# EAGLE design EnvSens (EAGLE 9.6.2)
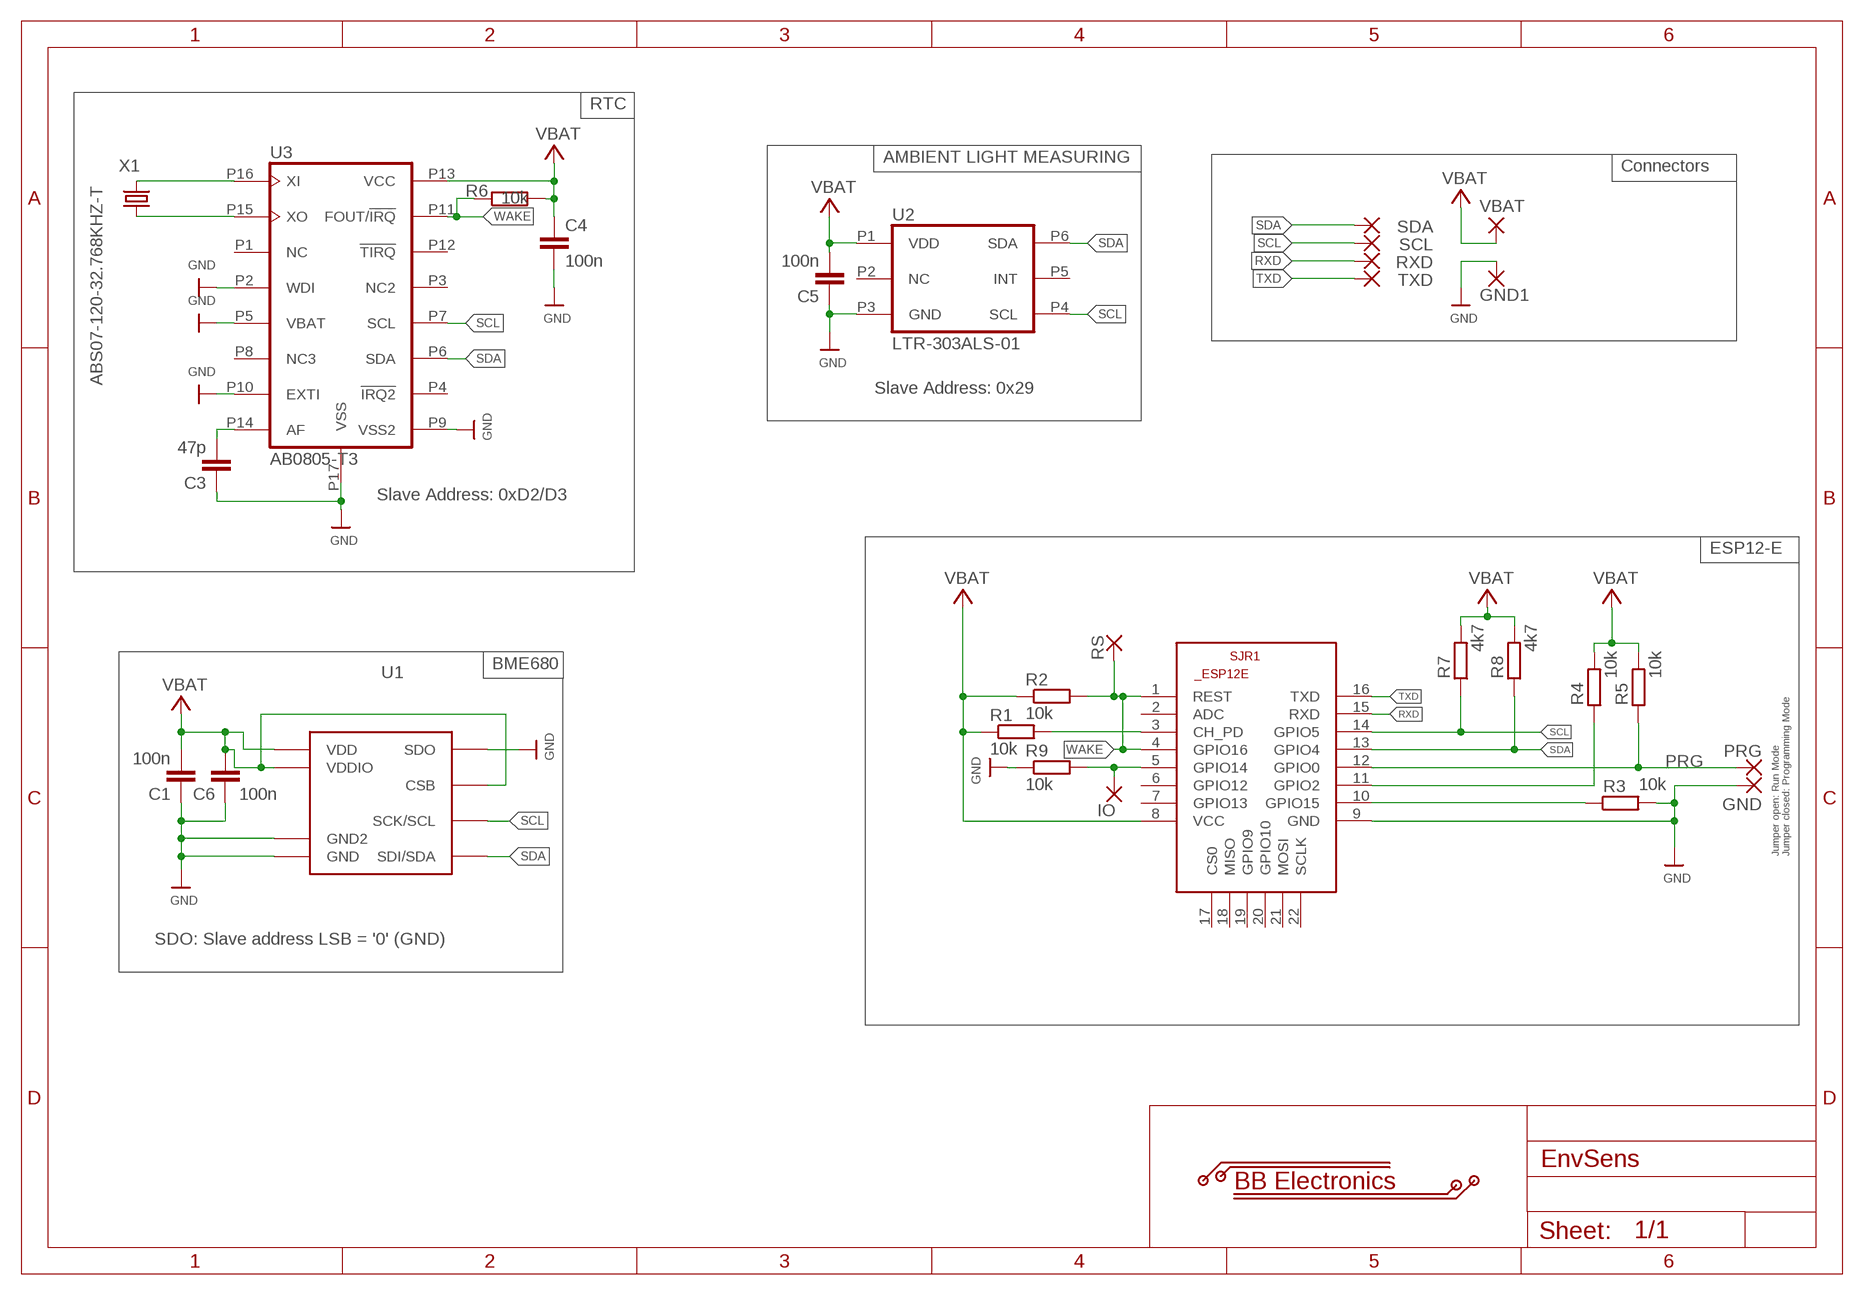
[diagram p0: schematic, sheet 1]

## Parts
C1  100n  C0603  [0603]
C3  47p  C0603  [0603]
C4  100n  C0603  [0603]
C5  100n  C0603  [0603]
C6  100n  C0603  [0603]
GND  SMD2  [SMD1,27-2,54]
GND1  SMD5  [SMD2,54-5,08]
IO  SMD2  [SMD1,27-2,54]
PRG  SMD2  [SMD1,27-2,54]
R1  10k  R0603  [0603]
R2  10k  R0603  [0603]
R3  10k  R0603  [0603]
R4  10k  R0603  [0603]
R5  10k  R0603  [0603]
R6  10k  R0603  [0603]
R7  4k7  R0603  [0603]
R8  4k7  R0603  [0603]
R9  10k  R0603  [0603]
RS  SMD2  [SMD1,27-2,54]
RXD  SMD2  [SMD1,27-2,54]
SCL  SMD2  [SMD1,27-2,54]
SDA  SMD2  [SMD1,27-2,54]
SJR1  ESP8266-12EESP12E  [ESP8266-ESP12E]
TXD  SMD2  [SMD1,27-2,54]
U1  BME680  [BME680]
U2  LTR-303ALS-01  [6-DFN]
U3  AB0805-T3  [16-VFQFN]
VBAT  SMD5  [SMD2,54-5,08]
X1  ABS07-120-32.768KHZ-T  [ABS07-120-32.768KHZ-T]

## Nets
GND: C1.P1 C3.P1 C4.P2 C5.P1 C6.P1 GND1.1(P) GND.1(P) R3.P2 R9.P1 SJR1.9(GND) U1.P1(GND) U1.P5(SDO) U1.P7(GND2) U2.P3(GND) U3.P2(WDI) U3.P5(VBAT) U3.P9(VSS2) U3.P10(EXTI) U3.P17(VSS)
GPIO: IO.1(P) R9.P2 SJR1.5(GPIO14)
N$1: R1.P2 SJR1.3(CH_PD)
N$2: R3.P1 SJR1.10(GPIO15)
N$4: R4.P1 SJR1.11(GPIO2)
N$5: C3.P2 U3.P14(AF)
N$6: U3.P16(XI) X1.P2
N$7: U3.P15(XO) X1.P1
PRG: PRG.1(P) R5.P1 SJR1.12(GPIO0)
RXD: RXD.1(P) SJR1.15(RXD)
SCL: R7.P1 SCL.1(P) SJR1.14(GPIO5) U1.P4(SCK/SCL) U2.P4(SCL) U3.P7(SCL)
SDA: R8.P1 SDA.1(P) SJR1.13(GPIO4) U1.P3(SDI/SDA) U2.P6(SDA) U3.P6(SDA)
TXD: SJR1.16(TXD) TXD.1(P)
VBAT: C1.P2 C4.P1 C5.P2 C6.P2 R1.P1 R2.P1 R4.P2 R5.P2 R6.P2 R7.P2 R8.P2 SJR1.8(VCC) U1.P2(CSB) U1.P6(VDDIO) U1.P8(VDD) U2.P1(VDD) U3.P13(VCC) VBAT.1(P)
WAKE: R2.P2 R6.P1 RS.1(P) SJR1.1(REST) SJR1.4(GPIO16) U3.P11(FOUT/!IRQ!)
Unconnected: SJR1.2(ADC) SJR1.6(GPIO12) SJR1.7(GPIO13) SJR1.17(CS0) SJR1.18(MISO) SJR1.19(GPIO9) SJR1.20(GPIO10) SJR1.21(MOSI) SJR1.22(SCLK) U2.P2(NC) U2.P5(INT) U3.P1(NC) U3.P3(NC2) U3.P4(!IRQ2!) U3.P8(NC3) U3.P12(!TIRQ!)

## Notes on the sheet
- RTC
- AMBIENT LIGHT MEASURING
- Connectors
- Slave Address: 0x29
- Slave Address: 0xD2/D3
- ESP12-E
- BME680
- Jumper open: Run Mode
  Jumper closed: Programming Mode
- SDO: Slave address LSB = '0' (GND)

## Library data of the parts
C1 C3-C6 = eigenebib:C0603
GND IO PRG RS RXD SCL SDA TXD = wirepad:SMD2: SMD PAD
GND1 VBAT = wirepad:SMD5: SMD PAD
R1-R9 = eigenebib:R0603
SJR1 = esp12e:ESP8266-12E: ESP8266-12E Library for Eagle CAD The author not responsible for any damages or errors!. Created by Suhail jr.lt;/author>
U1 = eigenebib:BME680
U2 = eigenebib:LTR-303ALS-01: SENSOR OPT AMBIENT 6DFN, Digikey: 160-2161-1-ND
U3 = eigenebib:AB0805-T3: Digikey: 535-11930-1-ND
X1 = eigenebib:ABS07-120-32.768KHZ-T: CRYSTAL 32.7680KHZ 6PF SMD, Digikey: 535-11937-1-ND

## Board
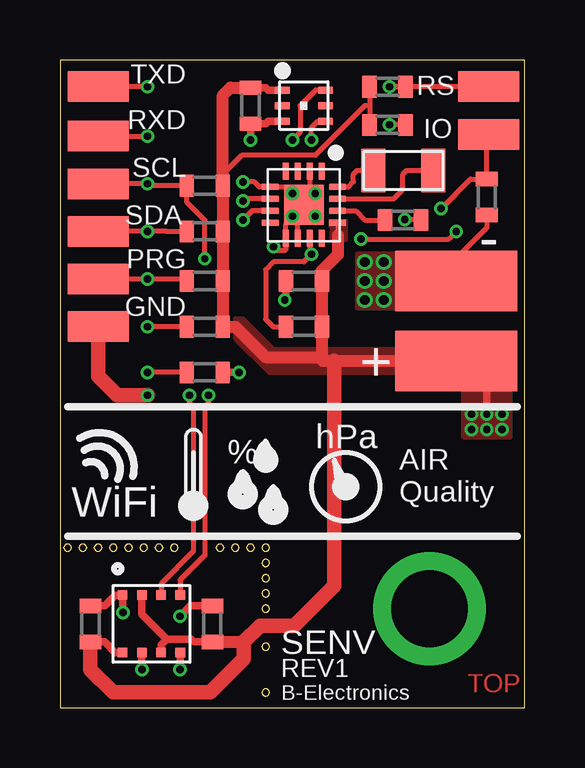
[diagram p1: board, top side]
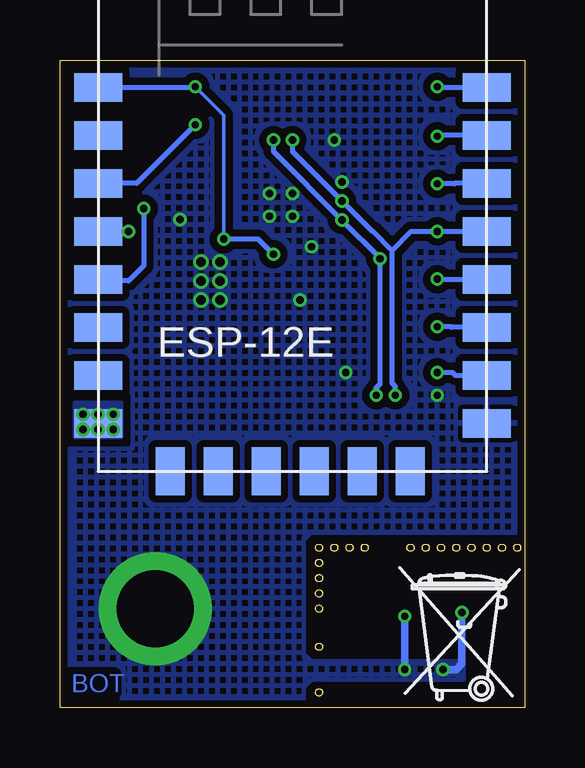
[diagram p2: board, bottom side, seen from below]

Size 19.37 x 26.99 mm. Coordinates in mm from the lower left corner, seen from the top.
Outline: 8.42,4.11 8.42,4.14 arc-165 8.72,4.15 8.72,4.14 8.72,4.11 arc-165 8.42,4.1 8.42,4.11
Outline: 3.34,6.65 3.34,6.68 3.34,6.69 arc-165 3.65,6.68 3.65,6.65 3.64,6.64 arc-165 3.34,6.65
Outline: 8.42,5.38 8.42,5.41 8.42,5.42 arc-165 8.72,5.41 8.72,5.38 8.72,5.37 arc-165 8.42,5.38
Outline: 8.42,2.52 8.42,2.56 8.42,2.56 arc-165 8.72,2.56 8.72,2.52 8.72,2.52 arc-165 8.42,2.52
Outline: 1.44,6.65 1.44,6.68 arc-165 1.74,6.69 1.74,6.68 1.74,6.65 arc-165 1.44,6.64 1.44,6.65
Outline: 4.61,6.65 4.61,6.68 4.61,6.69 arc-165 4.92,6.68 4.92,6.65 4.91,6.64 arc-165 4.61,6.65
Outline: 2.07,6.65 2.07,6.68 arc-165 2.37,6.69 2.38,6.68 2.38,6.65 arc-165 2.07,6.64 2.07,6.65
Outline: 8.42,4.75 8.42,4.78 8.42,4.79 arc-165 8.72,4.78 8.72,4.75 8.72,4.74 arc-165 8.42,4.75
Outline: 8.42,6.02 8.42,6.05 arc-165 8.72,6.06 8.72,6.05 8.72,6.02 arc-165 8.42,6.01 8.42,6.02
Outline: 7.15,6.65 7.15,6.68 arc-165 7.45,6.69 7.46,6.68 7.46,6.65 arc-165 7.15,6.64 7.15,6.65
Outline: 3.98,6.65 3.98,6.68 3.98,6.69 arc-165 4.28,6.68 4.28,6.65 4.28,6.64 arc-165 3.98,6.65
Outline: 8.42,6.65 8.42,6.68 arc-165 8.72,6.69 8.72,6.68 8.72,6.65 arc-165 8.42,6.64 8.42,6.65
Outline: 0.8,6.65 0.8,6.68 0.8,6.69 arc-165 1.1,6.68 1.1,6.65 1.1,6.64 arc-165 0.8,6.65
Outline: 8.42,0.62 8.42,0.65 arc-165 8.72,0.66 8.72,0.65 8.72,0.62 arc-165 8.42,0.61 8.42,0.62
Outline: 6.51,6.65 6.51,6.68 arc-165 6.82,6.69 6.82,6.68 6.82,6.65 arc-165 6.52,6.64 6.51,6.65
Outline: 7.79,6.65 7.79,6.68 arc-165 8.09,6.69 8.09,6.68 8.09,6.65 arc-165 7.79,6.64 7.79,6.65
Outline: 0.17,6.65 0.17,6.68 0.17,6.69 arc-165 0.47,6.68 0.47,6.65 0.47,6.64 arc-165 0.17,6.65
Outline: 2.71,6.65 2.71,6.68 arc-165 3.01,6.69 3.01,6.68 3.01,6.65 arc-165 2.71,6.64 2.71,6.65
Outline: 0,26.99 0,0 19.37,0 19.37,26.99 0,26.99
Copper layers (1*16): Top 0.018mm / dielectric 1.55mm / Bottom 0.018mm
Design rules "Multi-CB_2L_125um-Tracks_OL35um *": minimum track width 0.125mm, minimum drill 0.2mm, track to track 0.125mm, track to pad 0.125mm, pad to pad 0.125mm, via to via 0.125mm, smd to smd 0mil, copper to edge 0.2mm, drill to drill 0.2mm, minimum pad ring 0.125mm, minimum via ring 0.125mm, stop-mask expansion 2mil, vias tented up to drill 0.45mm, thermal gap 0.2mm

### Footprints (pad centres in the part's own frame; a part is rotated, then mirrored left to right if it is on the bottom)
0603 = smd 0.6 x 0.9: P1 -0.75,-0.003; P2 0.75,-0.003
SMD1,27-2,54 = smd 1.27 x 2.54: 1 0,0
SMD2,54-5,08 = smd 2.54 x 5.08: 1 0,0
ESP8266-ESP12E = smd 2 x 1.2: 1 -7.62,5.84; 2 -7.62,3.84; 3 -7.62,1.84; 4 -7.62,-0.16; 5 -7.62,-2.16; 6 -7.62,-4.16; 7 -7.62,-6.16; 8 -7.62,-8.16; 9 8.58,-8.16; 10 8.58,-6.16; 11 8.58,-4.16; 12 8.58,-2.16; 13 8.58,-0.16; 14 8.58,1.84; 15 8.58,3.84; 16 8.58,5.84 | smd 1.2 x 2: 17 -4.62,-10.16; 18 -2.62,-10.16; 19 -0.62,-10.16; 20 1.38,-10.16; 21 3.38,-10.16; 22 5.38,-10.16
BME680 = smd 0.4 x 0.4: P1 1.2,1.2; P2 1.2,0.4; P3 1.2,-0.4; P4 1.2,-1.2; P5 -1.2,-1.2; P6 -1.2,-0.4; P7 -1.2,0.4; P8 -1.2,1.2
6-DFN = smd 0.65 x 0.3: P1 -0.9,0.65; P2 -0.9,0; P3 -0.9,-0.65; P4 0.9,-0.65; P5 0.9,0; P6 0.9,0.65
16-VFQFN = smd 0.7 x 0.25: P1 -1.4,0.75; P2 -1.4,0.25; P3 -1.4,-0.25; P4 -1.4,-0.75; P9 1.4,-0.75; P10 1.4,-0.25; P11 1.4,0.25; P12 1.4,0.75 | smd 0.25 x 0.7: P5 -0.75,-1.4; P6 -0.25,-1.4; P7 0.25,-1.4; P8 0.75,-1.4; P13 0.75,1.4; P14 0.25,1.4; P15 -0.25,1.4; P16 -0.75,1.4 | smd 1.65 x 1.65: P17 0,0
ABS07-120-32.768KHZ-T = smd 1 x 1.8: P1 -1.27,0; P2 1.23,0

### Placement (x,y rotation side)
C1  6.35,3.49 270 top
C3  14.29,20.32 180 top
C4  10.16,17.78 180 top
C5  7.94,25.08 90 top
C6  1.27,3.49 270 top
GND  1.59,15.88 90 top
GND1  16.51,17.78 90 top
IO  17.86,23.89 90 top
PRG  1.59,17.86 90 top
R1  13.65,24.29 0 top
R2  13.65,25.88 0 top
R3  6.03,13.97 0 top
R4  6.03,15.88 0 top
R5  6.03,17.78 0 top
R6  10.16,15.88 0 top
R7  6.03,21.75 0 top
R8  6.03,19.84 0 top
R9  17.78,21.27 90 top
RS  17.86,25.88 90 top
RXD  1.59,23.81 90 top
SCL  1.59,21.83 90 top
SDA  1.59,19.84 90 top
SJR1  10.16,20 0 bottom
TXD  1.59,25.88 90 top
U1  3.81,3.49 90 top
U2  10.16,25.08 0 top
U3  10.16,20.95 270 top
U$5  [TONNE_10.00]  3.1,1.75 0 bottom
VBAT  16.51,14.45 90 top
X1  14.29,22.38 180 top

### Tracks (layer width: path | path; a pad name or v marks a point on that pad's centre or on a via)
GND  (via drill 0.3, 0.41, 3.2)
  Top 0.203: U3.P10 9.91,20.64 | 9.91,20.64 9.91,20.7 U3.P17 | 9.91,20.64 9.41,20.14 U3.P9 9.41,19.09 9.37,19.05 9.05,19.05 v8.89,19.21 | U3.P17 9.41,21.7 U3.P5 8.3,21.7 8.1,21.91 v7.62,21.91 | U3.P2 10.41,21.2 U3.P17 | C3.P1 14.39,20.32 v14.37,20.35 | 17.78,17.78 GND1.1 16.19,17.78 15.88,18.1 17.78,20 R9.P1
  Top 0.305: C4.P2 9.41,17.03 v9.37,16.99 | R3.P2 v7.46,13.97 | U2.P3 8.68,24.43 8.57,24.33 C5.P1 7.94,23.82 7.94,23.81 v7.94,23.65 | U1.P7 v3.41,1.59 | U1.P5 v5.01,1.6 v5,1.59 | v2.62,3.97 2.62,4.13 2.61,4.14 U1.P1 2.31,4.69 1.86,4.24 C6.P1 | C1.P1 5.43,4.24 v5,3.81
  Top 0.61: GND.1 1.59,13.81 2.38,13.02 v3.65,13.02
  Bottom 0.305: v2.62,3.97 2.62,1.83 2.86,1.59 v3.41,1.59 | v5,3.81 v5,1.59
  other vias: 9.68,21.43 10.64,21.43 9.68,20.48 10.64,20.48 15.4,4.13 12.7,18.57 12.7,17.78 12.7,16.99 13.49,16.99 13.49,17.78 13.49,18.57
  pour Bottom (isolate 0.305, rank 2, hatched): 0,26.99 19.37,26.99 19.37,0 9.21,0 9.21,0.87 8.89,1.19 2.54,1.19 2.54,1.91 8.89,1.91 9.21,2.22 9.21,6.99 8.89,7.3 0,7.3
  pour Top (no thermals): 14.61,18.89 12.38,18.89 12.38,16.67 14.61,16.67
GPIO  (via drill 0.3)
  Top 0.203: R9.P2 17.78,23.82 IO.1 | R9.P2 17.58,22.02 17.46,21.91 | v15.88,20.8 17.1,22.02 R9.P2
  Bottom 0.203: SJR1.5 17.72,17.78 16.51,17.78 15.88,18.41 v15.88,20.8
N$1  (via drill 0.3)
  Top 0.203: R1.P2 v13.73,24.29
  Bottom 0.203: 17.53,21.84 SJR1.3 16.18,21.84 v13.73,24.29
N$2  (via drill 0.3)
  Top 0.203: 5.19,13.97 v3.65,13.97
  Top 0.305: R3.P1 5.19,13.96 5.19,13.97
  Bottom 0.203: v3.65,13.97 3.02,13.97 2.89,13.84 SJR1.10
N$4  (via drill 0.3)
  Top 0.203: R4.P1 v3.65,15.88
  Top 0.305: R4.P1
  Bottom 0.203: SJR1.11 3.05,15.84 3.08,15.88 v3.65,15.88
N$5
  Top 0.203: U3.P14 12.31,20.7 12.7,20.32 C3.P2
N$6
  Top 0.203: U3.P16 12.02,21.7 12.22,21.91 12.22,22.23 12.38,22.38 X1.P2
N$7
  Top 0.203: U3.P15 13.9,21.2 14.29,21.59 14.29,22.23 14.45,22.38 X1.P1
PRG  (via drill 0.3)
  Top 0.203: R5.P1 5.2,17.86 v3.65,17.86 PRG.1
  Bottom 0.203: v3.65,17.86 3.63,17.84 SJR1.12
RXD  (via drill 0.3)
  Top 0.203: RXD.1 v3.65,23.81
  Bottom 0.203: SJR1.15 3.65,23.84 v3.65,23.81
SCL  (via drill 0.3)
  Top 0.203: SCL.1 v3.65,21.83 3.65,21.79 3.69,21.75 R7.P1 5.28,21.07 6.03,20.32 v6.03,18.7 | U3.P7 8.01,20.7 v7.62,20.32 | v10.48,23.65 10.48,24.17 10.74,24.43 U2.P4 | v6.19,13.02 6.19,12.7 6.03,12.54 6.03,6.35 5.01,5.33 U1.P4
  Bottom 0.203: v10.48,23.65 10.48,23.18 v7.62,20.32 6.03,18.73 v6.03,18.7 6.03,13.49 6.19,13.34 v6.19,13.02 | v3.65,21.83 2.94,21.83 2.92,21.84 SJR1.14
SDA  (via drill 0.3)
  Top 0.203: SDA.1 v3.65,19.84 4.45,19.84 R8.P1 | U2.P6 10.65,25.73 10,25.08 10,23.97 v9.68,23.65 | U3.P6 7.71,21.2 v7.62,21.11 | v5.4,13.02 5.4,12.7 5.56,12.54 5.56,6.51 4.21,5.16 U1.P3
  Bottom 0.203: SJR1.13 v3.65,19.84 4.74,19.84 5.53,19.05 | v9.68,23.65 9.68,23.18 v7.62,21.11 6.35,19.84 6.32,19.84 5.53,19.05 | v5.4,13.02 5.4,13.39 5.53,13.52 5.53,19.05
TXD  (via drill 0.3)
  Top 0.203: v3.65,25.88 TXD.1
  Bottom 0.203: v3.65,25.88 3.62,25.84 SJR1.16
VBAT  (via drill 0.3)
  Top 0.203: 11.59,19.68 11.59,20.18 U3.P13 | 6.78,22.23 7.58,23.02 10.64,23.02 12.7,25.08 12.9,25.08 | R2.P1 12.9,25.08 | 12.9,25.08 R1.P1
  Top 0.305: VBAT.1 17.78,13.65 v17.78,12.22 | U2.P1 8.68,25.73 8.57,25.83 C5.P2 | C6.P2 1.86,2.74 2.31,2.29 U1.P8 | U1.P6 4.21,2.62 4.45,2.86 | 4.45,2.86 5.48,2.86 5.59,2.74 C1.P2 | U1.P2 3.41,3.89 4.45,2.86
  Top 0.508: 11.59,19.68 11.59,18.89 10.91,18.21 C4.P1 R6.P2 10.91,14.72 10.79,14.61 | VBAT.1 11.43,14.45 10.95,14.45 10.79,14.61 | 10.79,14.61 8.57,14.61 7.3,15.87 R4.P2 R5.P2 R8.P2 R7.P2 6.78,22.23 6.78,25.52 7.1,25.83 C5.P2 | C1.P2 7.66,2.74
  Top 0.61: 11.43,14.45 11.43,5.08 9.76,3.41 8.33,3.41 7.66,2.74 7.66,2.04 6.26,0.64 2.22,0.64 1.27,1.59 C6.P2
  other vias: 18.41,11.59 18.41,12.22 17.78,11.59 17.14,12.22 17.14,11.59
  pour Top (isolate 0.203, no thermals): 11.11,20.64 11.11,19.53 11.91,19.53 11.91,20.64
  pour Bottom (isolate 0.305, no thermals): 18.73,12.7 16.83,12.7 16.83,11.27 18.73,11.27
  pour Top (isolate 0.406, no thermals): 16.83,11.27 16.83,15.56 18.73,15.56 18.73,11.27
  pour Top (no thermals): 14.29,14.92 8.89,14.92 7.62,16.19 7.3,16.19 7.3,15.4 8.73,13.97 14.29,13.97
WAKE  (via drill 0.3)
  Top 0.203: U3.P11 10.41,18.96 v10.48,18.89 10.16,18.57 8.89,18.57 8.57,18.26 8.57,16.19 8.89,15.87 R6.P1 | v12.54,19.53 16.19,19.53 v16.51,19.84 | R2.P2 v13.73,25.88 RS.1
  Bottom 0.152: v13.73,25.88 12.54,24.69 v12.54,19.53
  Bottom 0.203: v12.54,19.53 11.11,19.53 v10.48,18.89 | v16.51,19.84 SJR1.4 | SJR1.1 13.77,25.84 v13.73,25.88

### Text on the board
Top: TOP
Bottom: BOT
tPlace: hPa | % | AIR / Quality | WiFi | SENV | REV1 | B-Electronics
tNames: - | +